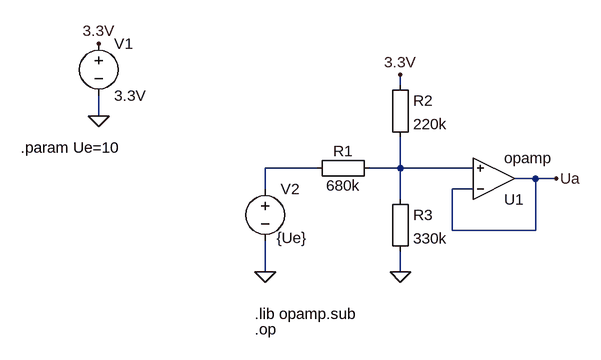
[diagram p0: schematic pm10Vsim.asc]
pm10Vsim.asc, the LTspice schematic file:
Version 4
SHEET 1 880 680
WIRE 528 192 528 176
WIRE 64 240 64 208
WIRE 400 320 320 320
WIRE 528 320 528 272
WIRE 528 320 480 320
WIRE 640 320 528 320
WIRE 736 336 704 336
WIRE 768 336 736 336
WIRE 320 352 320 320
WIRE 640 352 608 352
WIRE 528 368 528 320
WIRE 608 416 608 352
WIRE 736 416 736 336
WIRE 736 416 608 416
WIRE 320 480 320 432
WIRE 528 480 528 448
FLAG 64 128 3.3V
FLAG 64 240 0
FLAG 528 480 0
FLAG 320 480 0
FLAG 528 176 3.3V
FLAG 768 336 Ua
SYMBOL voltage 64 112 R0
WINDOW 123 0 0 Left 0
WINDOW 39 0 0 Left 0
SYMATTR InstName V1
SYMATTR Value 3.3V
SYMBOL Misc\\EuropeanResistor 496 304 R90
WINDOW 0 5 56 VBottom 2
WINDOW 3 27 56 VTop 2
SYMATTR InstName R1
SYMATTR Value 680k
SYMBOL Misc\\EuropeanResistor 512 176 R0
SYMATTR InstName R2
SYMATTR Value 220k
SYMBOL Misc\\EuropeanResistor 512 352 R0
SYMATTR InstName R3
SYMATTR Value 330k
SYMBOL voltage 320 336 R0
WINDOW 3 18 91 Left 2
WINDOW 123 0 0 Left 0
WINDOW 39 0 0 Left 0
SYMATTR InstName V2
SYMATTR Value {Ue}
SYMBOL OpAmps\\opamp 672 400 M180
SYMATTR InstName U1
TEXT 304 544 Left 2 !.lib opamp.sub
TEXT -56 288 Left 2 !.param Ue=10
TEXT 304 568 Left 2 !.op

The netlist it stands for:
* pm10Vsim.asc
V1 3.3V 0 3.3V
R1 N002 N001 680k
R2 3.3V N002 220k
R3 N002 0 330k
V2 N001 0 {Ue}
XU1 Ua N002 Ua opamp Aol=100K GBW=10Meg  ; pins invin noninvin out
.lib opamp.sub
.param Ue=10
.op
.backanno
.end